# Altium project MB1209.PrjPcb
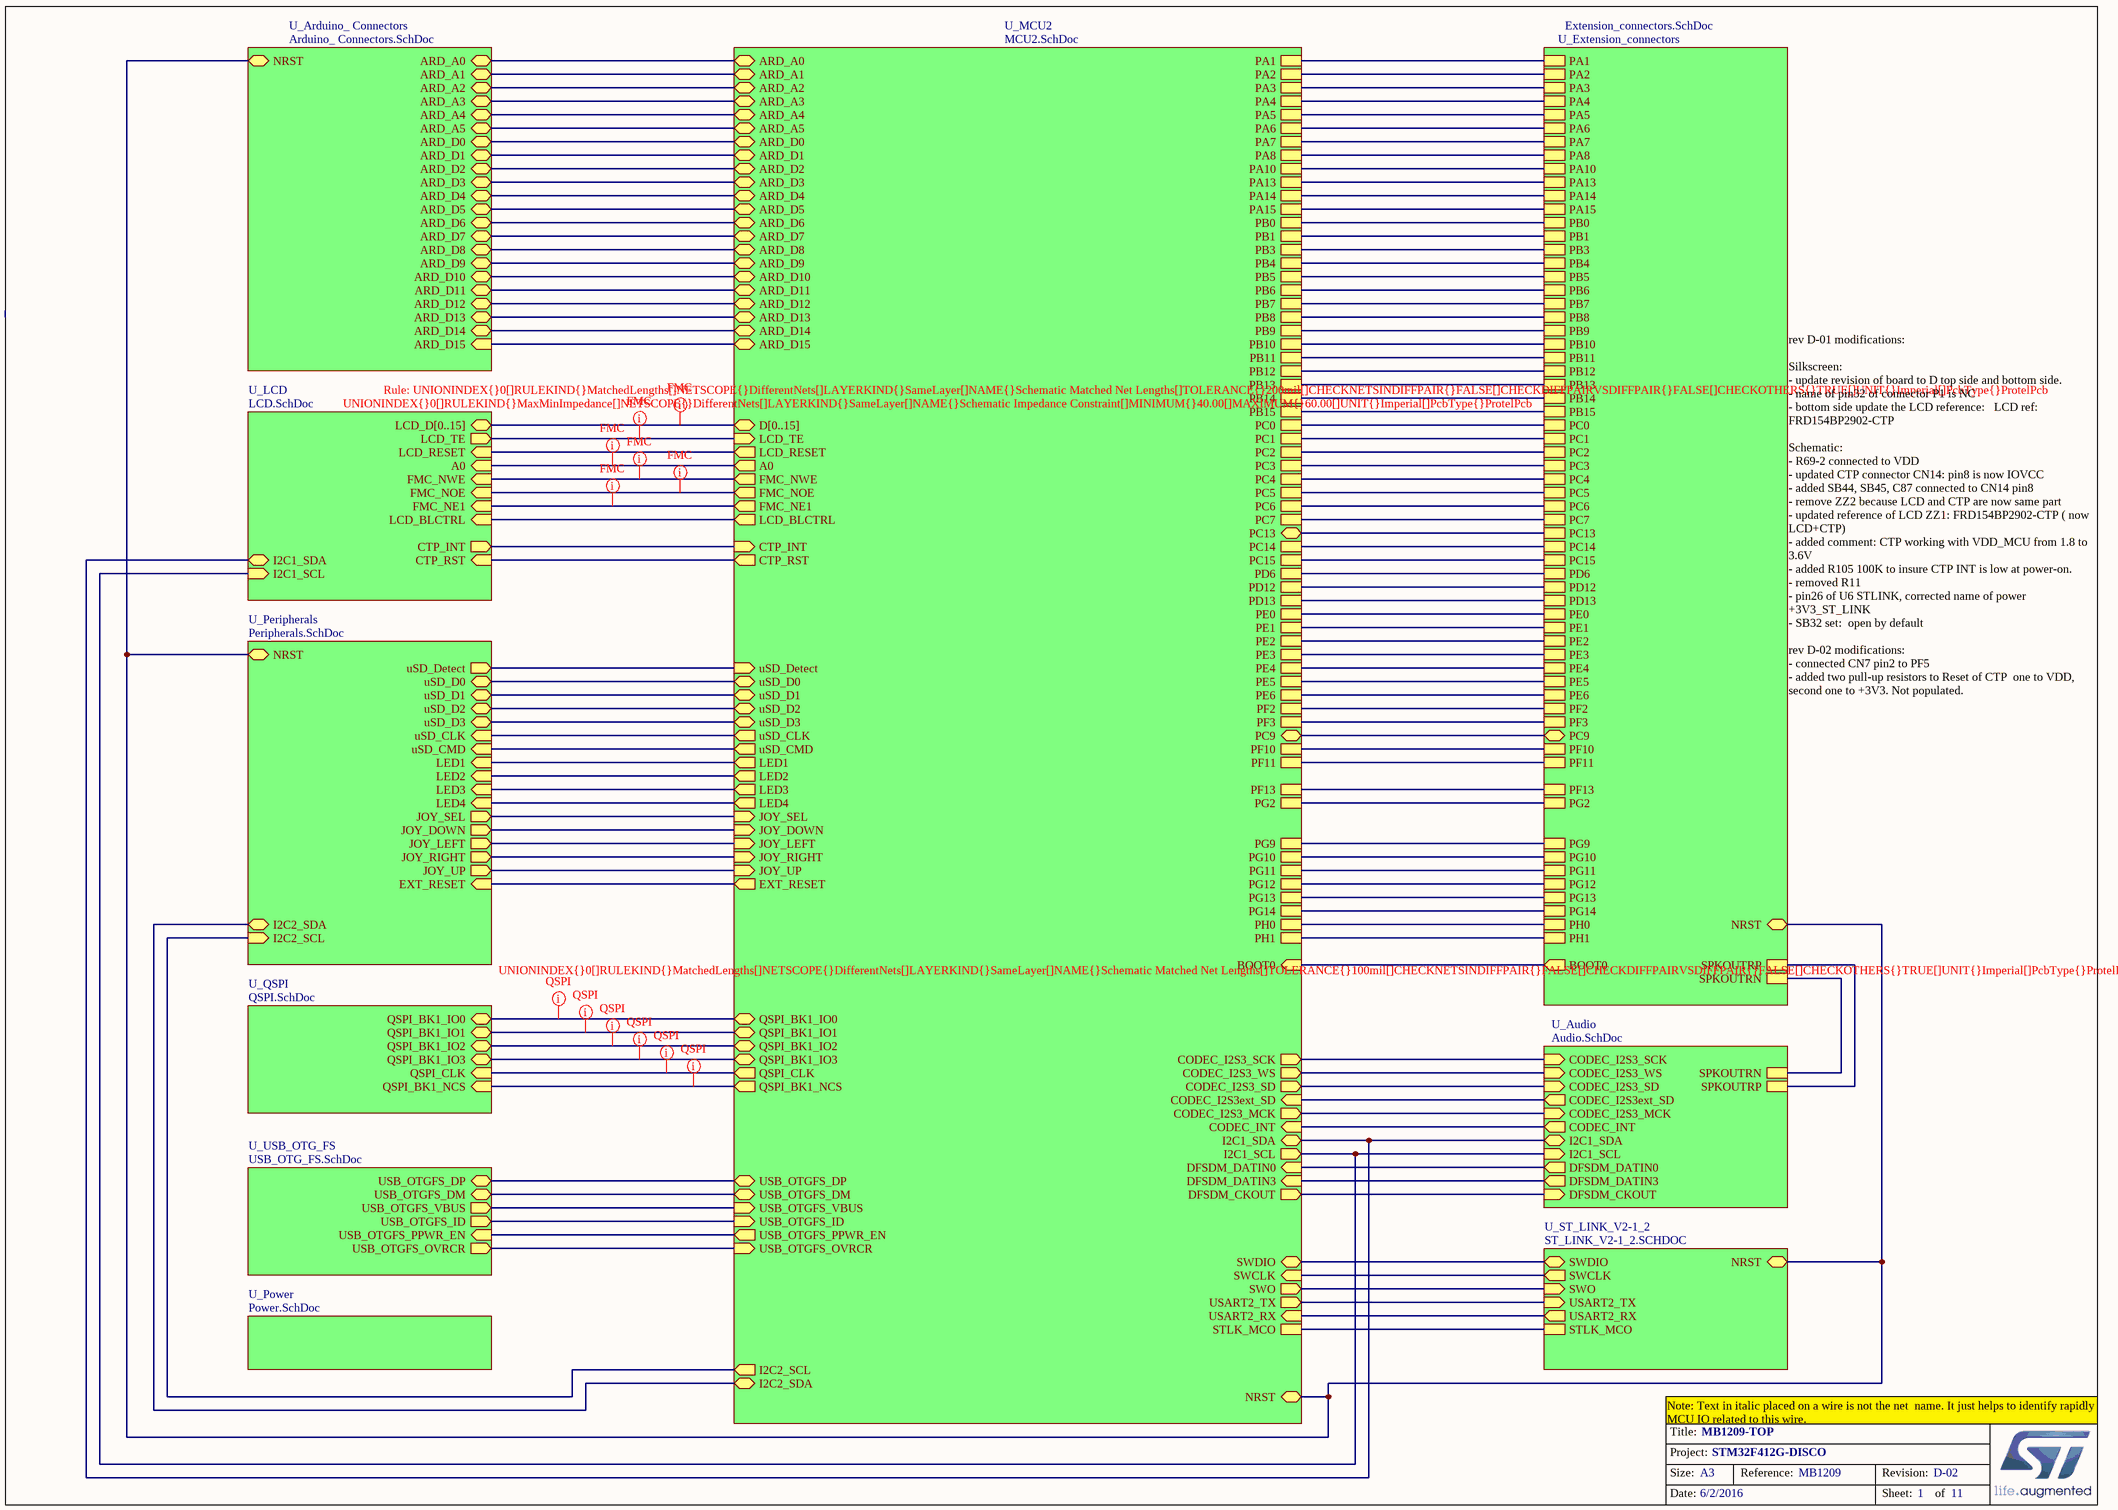
[diagram p0: MB1209.SchDoc]
6 sheets, 144 parts. Net scope: hierarchical (ports join the sheet entries above them; power ports are global).
Sheets:
  MB1209.SchDoc
    U_Extension_connectors = Extension_connectors.SchDoc
    U_Peripherals = Peripherals.SchDoc
    U_QSPI = QSPI.SchDoc
    U_Power = Power.SchDoc
    U_ST_LINK_V2-1_2 = ST_LINK_V2-1_2.SCHDOC

## Sheet MB1209.SchDoc: MB1209-TOP
size A3; Date: 3/31/2015; Author: P.A.; CompanyName: STMicroelectronics; Organization: Microcontrollers Division; Address1: 12, Rue Jules HOROWITZ; Address2: 38019 Grenoble; Address3: FRANCE; DocumentNumber: MB1209; Revision: D-02; SheetNumber: 1; SheetTotal: 11; Project: STM32F412G-DISCO; ModifiedDate: 6/2/2016

### Sub-sheets
U_Arduino_ Connectors = Arduino_ Connectors.SchDoc (file not in this document): NRST (bidir), ARD_A0 (bidir), ARD_A1 (bidir), ARD_A2 (bidir), ARD_A3 (bidir), ARD_A4 (bidir), ARD_A5 (bidir), ARD_D5 (bidir), ARD_D4 (bidir), ARD_D3 (bidir), ARD_D2 (bidir), ARD_D1 (bidir), ARD_D0 (bidir), ARD_D13 (bidir), ARD_D12 (bidir), ARD_D11 (bidir), ARD_D10 (bidir), ARD_D9 (bidir), ARD_D8 (bidir), ARD_D6 (bidir), ARD_D7 (bidir), ARD_D15 (in), ARD_D14 (bidir)
U_Audio = Audio.SchDoc (file not in this document): CODEC_INT (out), DFSDM_DATIN0 (out), DFSDM_CKOUT (in), SPKOUTRN, SPKOUTRP, DFSDM_DATIN3 (out), CODEC_I2S3_SCK (in), CODEC_I2S3_WS (in), CODEC_I2S3_SD (in), I2C1_SCL (in), CODEC_I2S3_MCK (in), I2C1_SDA (bidir), CODEC_I2S3ext_SD (out)
U_Extension_connectors = Extension_connectors.SchDoc: PC0, PC2, PA4, PA6, PC4, PB0, PB10, PB12, PB14, PD12, PC1, PC3, PA1, PA7, PC5, PB1, PA5, PB11, PB13, PB15, PD13, PH1, PC15, PC13, PE1, PB7, PB5, PB3, PE5, PE3, PB9, PD6, PA13, PA15, PC7, PH0, PC14, PE6, PE4, PE2, PE0, PB8, PB6, PA14, PA10, PA8, PB4, PC6, PA2, PA3, PF2, PF3, PF10, PF11, PF13, PG2, PG9, PG10, PG11, PG12, PG13, PG14, SPKOUTRN, SPKOUTRP, BOOT0 (out), NRST, PC9 (bidir)
U_LCD = LCD.SchDoc (file not in this document): LCD_RESET (in), A0 (in), FMC_NWE (in), FMC_NOE (in), FMC_NE1 (in), LCD_TE (out), LCD_BLCTRL (in), LCD_D[0..15] (bidir), I2C1_SDA (bidir), I2C1_SCL (in), CTP_INT (out), CTP_RST (in)
U_MCU2 = MCU2.SchDoc (file not in this document): uSD_D0 (bidir), uSD_D1 (bidir), uSD_D2 (bidir), uSD_D3 (bidir), uSD_CLK (out), uSD_CMD (out), D[0..15] (bidir), A0 (out), NRST (bidir), QSPI_BK1_IO3 (bidir), FMC_NOE (out), FMC_NWE (out), LED3 (out), LED4 (out), QSPI_BK1_IO2 (bidir), QSPI_BK1_IO0 (bidir), QSPI_BK1_IO1 (bidir), uSD_Detect (in), USB_OTGFS_VBUS (in), USB_OTGFS_ID (in), USB_OTGFS_DM (bidir), DFSDM_DATIN0 (in), QSPI_CLK (out), DFSDM_CKOUT (out), FMC_NE1 (out), LCD_RESET (out), LED1 (out), LED2 (out), JOY_RIGHT (in), JOY_LEFT (in), JOY_UP (in), JOY_DOWN (in), QSPI_BK1_NCS (out), USB_OTGFS_OVRCR (in), USB_OTGFS_PPWR_EN (out), SWO (out), SWDIO (bidir), SWCLK (in), USART2_TX (out), USART2_RX (in), EXT_RESET (out), PH0, PH1, STLK_MCO, JOY_SEL (in), CODEC_INT (in), LCD_TE (in), LCD_BLCTRL (out), PC0, PC2, PD12, PC1, PC3, PD13, PE6, PE4, PE2, PE0, PE1, PE5, PE3, PD6, PA4, PA6, PA2, PA1, PA7, PA5, PA3, PA14, PA10, PA8, PA13, PA15, PB10, PB12, PB14, PB11, PB13, PB15, PB8, PB6, PB4, PB7, PB5, PB3, PB9, PC4, PC5, PC14, PC6, PC15, PC7, PB1, PB0, PF2, PF3, PF10, PF11, PF13, PG2, PG9, PG10, PG11, PG12, PG13, PG14, I2C2_SDA (bidir), I2C2_SCL (out), USB_OTGFS_DP (bidir), PC13, BOOT0 (in), DFSDM_DATIN3 (in), I2C1_SCL (out), I2C1_SDA (bidir), CODEC_I2S3_WS (out), CODEC_I2S3_SCK (out), CODEC_I2S3_SD (out), CODEC_I2S3_MCK (out), CODEC_I2S3ext_SD (in), CTP_INT (in), ARD_D3 (bidir), CTP_RST (out), ARD_D5, ARD_D4, ARD_A0, ARD_D2, ARD_D1, ARD_D0, ARD_D8, ARD_D7, ARD_A1, ARD_A2, ARD_A3, ARD_A4, ARD_D12, ARD_D13, ARD_D11, ARD_D10, ARD_A5, ARD_D15, ARD_D14, ARD_D9, ARD_D6, PC9 (bidir)
U_Peripherals = Peripherals.SchDoc: uSD_CLK (in), uSD_CMD (in), uSD_D0 (bidir), uSD_D1 (bidir), uSD_D2 (bidir), uSD_D3 (bidir), uSD_Detect (out), EXT_RESET (in), LED1 (in), LED2 (in), LED3 (in), LED4 (in), NRST (bidir), I2C2_SDA (bidir), I2C2_SCL (in), JOY_SEL (out), JOY_DOWN (out), JOY_LEFT (out), JOY_RIGHT (out), JOY_UP (out)
U_Power = Power.SchDoc: no entries
U_QSPI = QSPI.SchDoc: QSPI_BK1_IO0 (bidir), QSPI_BK1_IO2 (bidir), QSPI_BK1_IO1 (bidir), QSPI_BK1_IO3 (bidir), QSPI_CLK (in), QSPI_BK1_NCS (in)
U_ST_LINK_V2-1_2 = ST_LINK_V2-1_2.SCHDOC: STLK_MCO, NRST (bidir), SWCLK (out), SWDIO (bidir), SWO (in), USART2_TX (in), USART2_RX (out)
U_USB_OTG_FS = USB_OTG_FS.SchDoc (file not in this document): USB_OTGFS_VBUS (out), USB_OTGFS_DM (bidir), USB_OTGFS_DP (bidir), USB_OTGFS_ID (out), USB_OTGFS_OVRCR (out), USB_OTGFS_PPWR_EN (in)

### Nets
BOOT0: sheet U_MCU2/BOOT0, sheet U_Extension_connectors/BOOT0
NRST: sheet U_MCU2/NRST, sheet U_Extension_connectors/NRST, sheet U_Arduino_ Connectors/NRST, sheet U_Peripherals/NRST, sheet U_ST_LINK_V2-1_2/NRST
PA1: sheet U_MCU2/PA1, sheet U_Extension_connectors/PA1
PA2: sheet U_MCU2/PA2, sheet U_Extension_connectors/PA2
PA3: sheet U_MCU2/PA3, sheet U_Extension_connectors/PA3
PA4: sheet U_MCU2/PA4, sheet U_Extension_connectors/PA4
PA5: sheet U_MCU2/PA5, sheet U_Extension_connectors/PA5
PA6: sheet U_MCU2/PA6, sheet U_Extension_connectors/PA6
PA7: sheet U_MCU2/PA7, sheet U_Extension_connectors/PA7
PA8: sheet U_MCU2/PA8, sheet U_Extension_connectors/PA8
PA10: sheet U_MCU2/PA10, sheet U_Extension_connectors/PA10
PA13: sheet U_MCU2/PA13, sheet U_Extension_connectors/PA13
PA14: sheet U_MCU2/PA14, sheet U_Extension_connectors/PA14
PA15: sheet U_MCU2/PA15, sheet U_Extension_connectors/PA15
PB0: sheet U_MCU2/PB0, sheet U_Extension_connectors/PB0
PB1: sheet U_MCU2/PB1, sheet U_Extension_connectors/PB1
PB3: sheet U_MCU2/PB3, sheet U_Extension_connectors/PB3
PB4: sheet U_MCU2/PB4, sheet U_Extension_connectors/PB4
PB5: sheet U_MCU2/PB5, sheet U_Extension_connectors/PB5
PB6: sheet U_MCU2/PB6, sheet U_Extension_connectors/PB6
PB7: sheet U_MCU2/PB7, sheet U_Extension_connectors/PB7
PB8: sheet U_MCU2/PB8, sheet U_Extension_connectors/PB8
PB9: sheet U_MCU2/PB9, sheet U_Extension_connectors/PB9
PB10: sheet U_MCU2/PB10, sheet U_Extension_connectors/PB10
PB11: sheet U_MCU2/PB11, sheet U_Extension_connectors/PB11
PB12: sheet U_MCU2/PB12, sheet U_Extension_connectors/PB12
PB13: sheet U_MCU2/PB13, sheet U_Extension_connectors/PB13
PB14: sheet U_MCU2/PB14, sheet U_Extension_connectors/PB14
PB15: sheet U_MCU2/PB15, sheet U_Extension_connectors/PB15
PC0: sheet U_MCU2/PC0, sheet U_Extension_connectors/PC0
PC1: sheet U_MCU2/PC1, sheet U_Extension_connectors/PC1
PC2: sheet U_MCU2/PC2, sheet U_Extension_connectors/PC2
PC3: sheet U_MCU2/PC3, sheet U_Extension_connectors/PC3
PC4: sheet U_MCU2/PC4, sheet U_Extension_connectors/PC4
PC5: sheet U_MCU2/PC5, sheet U_Extension_connectors/PC5
PC6: sheet U_MCU2/PC6, sheet U_Extension_connectors/PC6
PC7: sheet U_MCU2/PC7, sheet U_Extension_connectors/PC7
PC13: sheet U_MCU2/PC13, sheet U_Extension_connectors/PC13
PC14: sheet U_MCU2/PC14, sheet U_Extension_connectors/PC14
PC15: sheet U_MCU2/PC15, sheet U_Extension_connectors/PC15
PD6: sheet U_MCU2/PD6, sheet U_Extension_connectors/PD6
PD12: sheet U_MCU2/PD12, sheet U_Extension_connectors/PD12
PD13: sheet U_MCU2/PD13, sheet U_Extension_connectors/PD13
PE0: sheet U_MCU2/PE0, sheet U_Extension_connectors/PE0
PE1: sheet U_MCU2/PE1, sheet U_Extension_connectors/PE1
PE2: sheet U_MCU2/PE2, sheet U_Extension_connectors/PE2
PE3: sheet U_MCU2/PE3, sheet U_Extension_connectors/PE3
PE4: sheet U_MCU2/PE4, sheet U_Extension_connectors/PE4
PE5: sheet U_MCU2/PE5, sheet U_Extension_connectors/PE5
PE6: sheet U_MCU2/PE6, sheet U_Extension_connectors/PE6
PF2: sheet U_MCU2/PF2, sheet U_Extension_connectors/PF2
PF3: sheet U_MCU2/PF3, sheet U_Extension_connectors/PF3
PF10: sheet U_MCU2/PF10, sheet U_Extension_connectors/PF10
PF11: sheet U_MCU2/PF11, sheet U_Extension_connectors/PF11
PF13: sheet U_MCU2/PF13, sheet U_Extension_connectors/PF13
PG2: sheet U_MCU2/PG2, sheet U_Extension_connectors/PG2
PG9: sheet U_MCU2/PG9, sheet U_Extension_connectors/PG9
PG10: sheet U_MCU2/PG10, sheet U_Extension_connectors/PG10
PG11: sheet U_MCU2/PG11, sheet U_Extension_connectors/PG11
PG12: sheet U_MCU2/PG12, sheet U_Extension_connectors/PG12
PG13: sheet U_MCU2/PG13, sheet U_Extension_connectors/PG13
PG14: sheet U_MCU2/PG14, sheet U_Extension_connectors/PG14
PH0: sheet U_MCU2/PH0, sheet U_Extension_connectors/PH0
PH1: sheet U_MCU2/PH1, sheet U_Extension_connectors/PH1
QSPI_BK1_IO0: sheet U_MCU2/QSPI_BK1_IO0, sheet U_QSPI/QSPI_BK1_IO0
QSPI_BK1_IO1: sheet U_MCU2/QSPI_BK1_IO1, sheet U_QSPI/QSPI_BK1_IO1
QSPI_BK1_IO2: sheet U_MCU2/QSPI_BK1_IO2, sheet U_QSPI/QSPI_BK1_IO2
QSPI_BK1_IO3: sheet U_MCU2/QSPI_BK1_IO3, sheet U_QSPI/QSPI_BK1_IO3
QSPI_BK1_NCS: sheet U_MCU2/QSPI_BK1_NCS, sheet U_QSPI/QSPI_BK1_NCS
QSPI_CLK: sheet U_MCU2/QSPI_CLK, sheet U_QSPI/QSPI_CLK
SPKOUTRN: sheet U_Extension_connectors/SPKOUTRN, sheet U_Audio/SPKOUTRN
SPKOUTRP: sheet U_Extension_connectors/SPKOUTRP, sheet U_Audio/SPKOUTRP
NetB2_1: sheet U_MCU2/JOY_LEFT, sheet U_Peripherals/JOY_LEFT
NetB2_2: sheet U_MCU2/JOY_SEL, sheet U_Peripherals/JOY_SEL
NetB2_3: sheet U_MCU2/JOY_DOWN, sheet U_Peripherals/JOY_DOWN
NetB2_4: sheet U_MCU2/JOY_RIGHT, sheet U_Peripherals/JOY_RIGHT
NetB2_6: sheet U_MCU2/JOY_UP, sheet U_Peripherals/JOY_UP
NetC69_1: sheet U_MCU2/STLK_MCO, sheet U_ST_LINK_V2-1_2/STLK_MCO
NetCN10_1: sheet U_MCU2/I2C2_SDA, sheet U_Peripherals/I2C2_SDA
NetCN10_3: sheet U_MCU2/I2C2_SCL, sheet U_Peripherals/I2C2_SCL
NetCN10_4: sheet U_MCU2/EXT_RESET, sheet U_Peripherals/EXT_RESET
NetCN13_1: sheet U_MCU2/uSD_D2, sheet U_Peripherals/uSD_D2
NetCN13_2: sheet U_MCU2/uSD_D3, sheet U_Peripherals/uSD_D3
NetCN13_3: sheet U_MCU2/uSD_CMD, sheet U_Peripherals/uSD_CMD
NetCN13_5: sheet U_MCU2/uSD_CLK, sheet U_Peripherals/uSD_CLK
NetCN13_7: sheet U_MCU2/uSD_D0, sheet U_Peripherals/uSD_D0
NetCN13_8: sheet U_MCU2/uSD_D1, sheet U_Peripherals/uSD_D1
NetP2_46: sheet U_MCU2/PC9, sheet U_Extension_connectors/PC9
NetR2_1: sheet U_MCU2/LED4, sheet U_Peripherals/LED4
NetR3_1: sheet U_MCU2/LED3, sheet U_Peripherals/LED3
NetR4_1: sheet U_MCU2/LED2, sheet U_Peripherals/LED2
NetR5_1: sheet U_MCU2/LED1, sheet U_Peripherals/LED1
NetR49_1: sheet U_MCU2/USART2_RX, sheet U_ST_LINK_V2-1_2/USART2_RX
NetR61_1: sheet U_MCU2/USART2_TX, sheet U_ST_LINK_V2-1_2/USART2_TX
NetR64_1: sheet U_MCU2/uSD_Detect, sheet U_Peripherals/uSD_Detect
NetSB2_1: sheet U_MCU2/SWDIO, sheet U_ST_LINK_V2-1_2/SWDIO
NetSB11_1: sheet U_MCU2/SWCLK, sheet U_ST_LINK_V2-1_2/SWCLK
NetSB28_2: sheet U_MCU2/SWO, sheet U_ST_LINK_V2-1_2/SWO
(unnamed): sheet U_MCU2/A0, sheet U_LCD/A0
(unnamed): sheet U_MCU2/FMC_NOE, sheet U_LCD/FMC_NOE
(unnamed): sheet U_MCU2/FMC_NWE, sheet U_LCD/FMC_NWE
(unnamed): sheet U_MCU2/USB_OTGFS_VBUS, sheet U_USB_OTG_FS/USB_OTGFS_VBUS
(unnamed): sheet U_MCU2/USB_OTGFS_ID, sheet U_USB_OTG_FS/USB_OTGFS_ID
(unnamed): sheet U_MCU2/USB_OTGFS_DM, sheet U_USB_OTG_FS/USB_OTGFS_DM
(unnamed): sheet U_MCU2/DFSDM_DATIN0, sheet U_Audio/DFSDM_DATIN0
(unnamed): sheet U_MCU2/DFSDM_CKOUT, sheet U_Audio/DFSDM_CKOUT
(unnamed): sheet U_MCU2/FMC_NE1, sheet U_LCD/FMC_NE1
(unnamed): sheet U_MCU2/LCD_RESET, sheet U_LCD/LCD_RESET
(unnamed): sheet U_MCU2/USB_OTGFS_OVRCR, sheet U_USB_OTG_FS/USB_OTGFS_OVRCR
(unnamed): sheet U_MCU2/USB_OTGFS_PPWR_EN, sheet U_USB_OTG_FS/USB_OTGFS_PPWR_EN
(unnamed): sheet U_MCU2/CODEC_INT, sheet U_Audio/CODEC_INT
(unnamed): sheet U_MCU2/LCD_TE, sheet U_LCD/LCD_TE
(unnamed): sheet U_MCU2/LCD_BLCTRL, sheet U_LCD/LCD_BLCTRL
(unnamed): sheet U_MCU2/USB_OTGFS_DP, sheet U_USB_OTG_FS/USB_OTGFS_DP
(unnamed): sheet U_MCU2/DFSDM_DATIN3, sheet U_Audio/DFSDM_DATIN3
(unnamed): sheet U_MCU2/I2C1_SCL, sheet U_Audio/I2C1_SCL, sheet U_LCD/I2C1_SCL
(unnamed): sheet U_MCU2/I2C1_SDA, sheet U_Audio/I2C1_SDA, sheet U_LCD/I2C1_SDA
(unnamed): sheet U_MCU2/CODEC_I2S3_WS, sheet U_Audio/CODEC_I2S3_WS
(unnamed): sheet U_MCU2/CODEC_I2S3_SCK, sheet U_Audio/CODEC_I2S3_SCK
(unnamed): sheet U_MCU2/CODEC_I2S3_SD, sheet U_Audio/CODEC_I2S3_SD
(unnamed): sheet U_MCU2/CODEC_I2S3_MCK, sheet U_Audio/CODEC_I2S3_MCK
(unnamed): sheet U_MCU2/CODEC_I2S3ext_SD, sheet U_Audio/CODEC_I2S3ext_SD
(unnamed): sheet U_MCU2/CTP_INT, sheet U_LCD/CTP_INT
(unnamed): sheet U_MCU2/ARD_D3, sheet U_Arduino_ Connectors/ARD_D3
(unnamed): sheet U_MCU2/CTP_RST, sheet U_LCD/CTP_RST
(unnamed): sheet U_MCU2/ARD_D5, sheet U_Arduino_ Connectors/ARD_D5
(unnamed): sheet U_MCU2/ARD_D4, sheet U_Arduino_ Connectors/ARD_D4
(unnamed): sheet U_MCU2/ARD_A0, sheet U_Arduino_ Connectors/ARD_A0
(unnamed): sheet U_MCU2/ARD_D2, sheet U_Arduino_ Connectors/ARD_D2
(unnamed): sheet U_MCU2/ARD_D1, sheet U_Arduino_ Connectors/ARD_D1
(unnamed): sheet U_MCU2/ARD_D0, sheet U_Arduino_ Connectors/ARD_D0
(unnamed): sheet U_MCU2/ARD_D8, sheet U_Arduino_ Connectors/ARD_D8
(unnamed): sheet U_MCU2/ARD_D7, sheet U_Arduino_ Connectors/ARD_D7
(unnamed): sheet U_MCU2/ARD_A1, sheet U_Arduino_ Connectors/ARD_A1
(unnamed): sheet U_MCU2/ARD_A2, sheet U_Arduino_ Connectors/ARD_A2
(unnamed): sheet U_MCU2/ARD_A3, sheet U_Arduino_ Connectors/ARD_A3
(unnamed): sheet U_MCU2/ARD_A4, sheet U_Arduino_ Connectors/ARD_A4
(unnamed): sheet U_MCU2/ARD_D12, sheet U_Arduino_ Connectors/ARD_D12
(unnamed): sheet U_MCU2/ARD_D13, sheet U_Arduino_ Connectors/ARD_D13
(unnamed): sheet U_MCU2/ARD_D11, sheet U_Arduino_ Connectors/ARD_D11
(unnamed): sheet U_MCU2/ARD_D10, sheet U_Arduino_ Connectors/ARD_D10
(unnamed): sheet U_MCU2/ARD_A5, sheet U_Arduino_ Connectors/ARD_A5
(unnamed): sheet U_MCU2/ARD_D15, sheet U_Arduino_ Connectors/ARD_D15
(unnamed): sheet U_MCU2/ARD_D14, sheet U_Arduino_ Connectors/ARD_D14
(unnamed): sheet U_MCU2/ARD_D9, sheet U_Arduino_ Connectors/ARD_D9
(unnamed): sheet U_MCU2/ARD_D6, sheet U_Arduino_ Connectors/ARD_D6

### Buses and harness runs
bus sheet U_LCD/LCD_D[0..15] = sheet U_MCU2/D[0..15]

### Layout directives
rule Matched Net Lengths [Tolerance = 200mil]; rule ? ; rule Impedance Constraint [Min = 40.00    Max = 60.00    ]: (no net found under the mark)
rule Matched Net Lengths [Tolerance = 200mil]; rule Impedance Constraint [Min = 40.00    Max = 60.00    ]: (no net found under the mark)
rule Matched Net Lengths [Tolerance = 100mil]: QSPI_BK1_IO0, QSPI_BK1_IO1, QSPI_BK1_IO2, QSPI_BK1_IO3, QSPI_BK1_NCS, QSPI_CLK

### Notes on the sheet
- rev D-01 modifications:
  Silkscreen:
  - update revision of board to D top side and bottom side.
  - name of pin32 of connector P1 is NC
  - bottom side update the LCD reference:   LCD ref: FRD154BP2902-CTP
  Schematic:
  - R69-2 connected to VDD
  - updated CTP connector CN14: pin8 is now IOVCC
  - added SB44, SB45, C87 connected to CN14 pin8
  - remove ZZ2 because LCD and CTP are now same part
  - updated reference of LCD ZZ1: FRD154BP2902-CTP ( now LCD+CTP)
  - added comment: CTP working with VDD_MCU from 1.8 to 3.6V
  - added R105 100K to insure CTP INT is low at power-on.
  - removed R11
  - pin26 of U6 STLINK, corrected name of power +3V3_ST_LINK
  - SB32 set:  open by default
  rev D-02 modifications:
  - connected CN7 pin2 to PF5
  - added two pull-up resistors to Reset of CTP  one to VDD, second one to +3V3. Not populated.
- Note: Text in italic placed on a wire is not the net  name. It just helps to identify rapidly MCU IO related to this wire.
- Title:
- Project:
- Size:
- Date:
- A3
- Reference:
- Sheet:
- Revision:
- of

## Sheet Extension_connectors.SchDoc: Extension connectors
size A4; Date: 01-DEC-2013; Author: P.A.; CompanyName: STMicroelectronics; Organization: Microcontrollers Division; Address1: 12, Rue Jules HOROWITZ; Address2: 38019 Grenoble; Address3: FRANCE; DocumentNumber: MB1209; Revision: D-02; SheetNumber: 9; SheetTotal: 11; Project: STM32F412G-DISCO; PageSetup: Record=PageOptions|CenterHorizontal=True|CenterVertical=True|PrintScale=1.38|XCorrection=1.00|YCorrection=1.00|PrintKind=1|BorderSize=5000000|LeftOffset=0|BottomOffset=0|Orientation=2|PaperLength=1000|PaperWidth=1000|Scale=100|PaperSource=15|PrintQuality=600|MediaType=1|DitherType=10|PaperKind=A3|PrintScaleMode=1; ModifiedDate: 6/2/2016
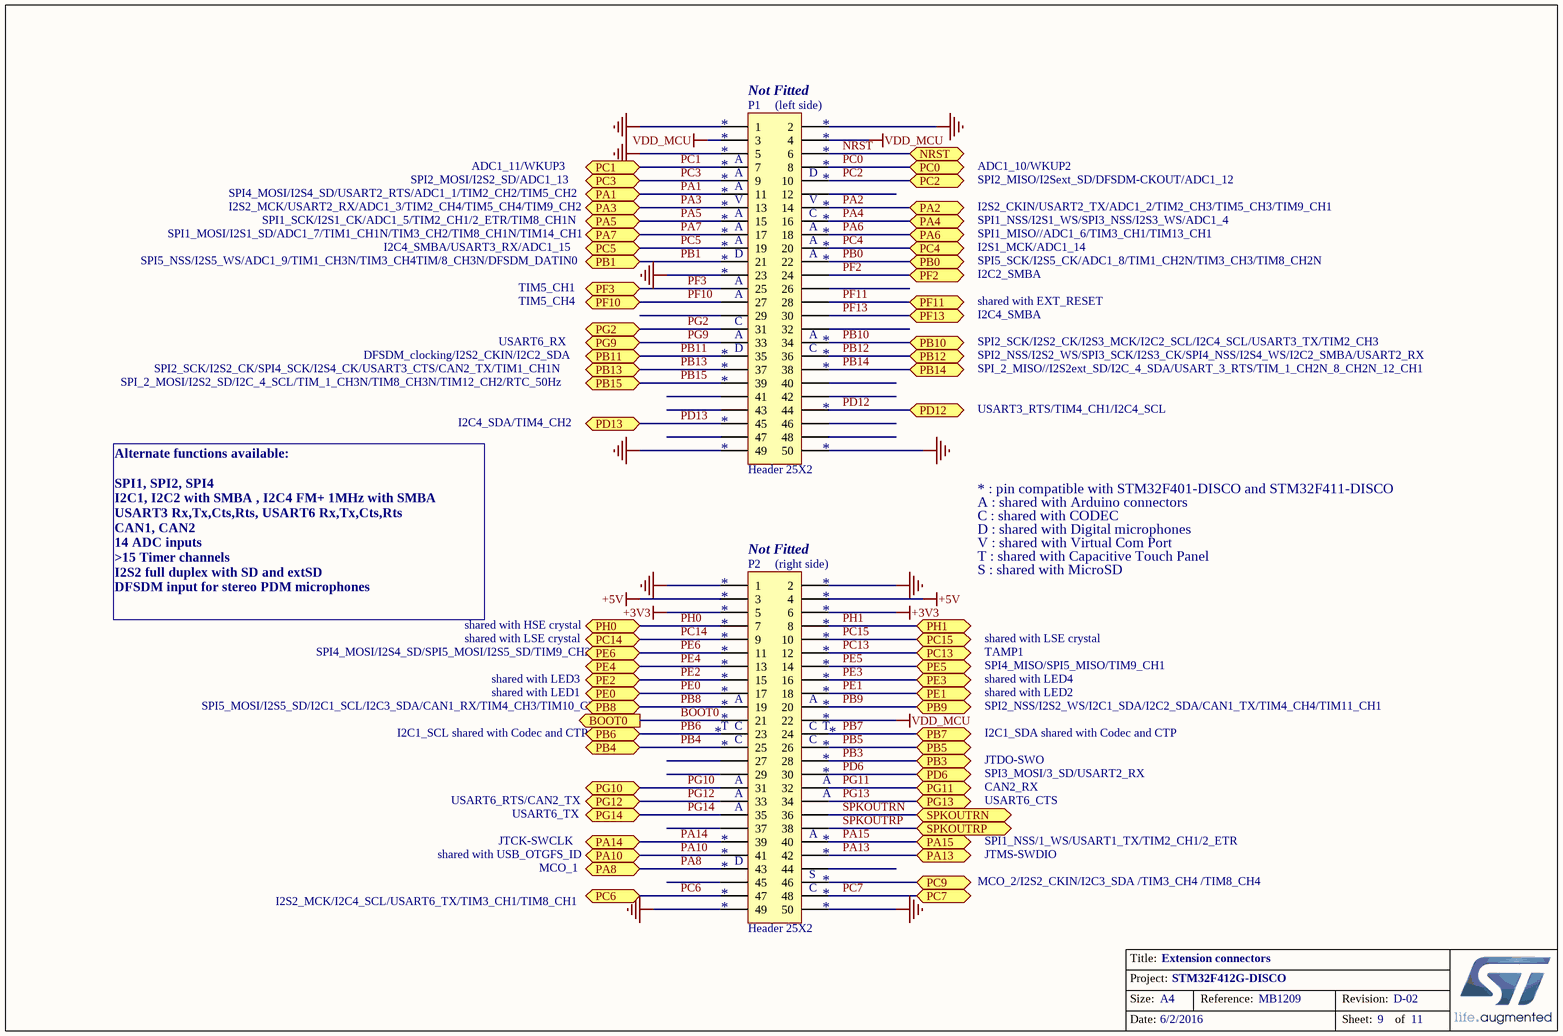
[diagram p1: Extension_connectors.SchDoc]

### Parts
P1  Header 25X2  [HDR_2X25_2R54_W]
P2  Header 25X2  [HDR_2X25_2R54_W]

### Ports
BOOT0 (out), NRST, PA1, PA2, PA3, PA4, PA5, PA6, PA7, PA8, PA10, PA13, PA14, PA15, PB0, PB1, PB3, PB4, PB5, PB6, PB7, PB8, PB9, PB10, PB11, PB12, PB13, PB14, PB15, PC0, PC1, PC2, PC3, PC4, PC5, PC6, PC7, PC9 (bidir), PC13, PC14, PC15, PD6, PD12, PD13, PE0, PE1, PE2, PE3, PE4, PE5, PE6, PF2, PF3, PF10, PF11, PF13, PG2, PG9, PG10, PG11, PG12, PG13, PG14, PH0, PH1, SPKOUTRN, SPKOUTRP

### Nets
+3V3: P2.5 P2.6
+5V: P2.3 P2.4
GND: P1.1 P1.2 P1.5 P1.23 P1.49 P1.50 P2.1 P2.2 P2.49 P2.50
VDD_MCU: P1.3 P1.4 P2.22
BOOT0: P2.21 ; port BOOT0
NRST: P1.6 ; port NRST
PA1: P1.11 ; port PA1
PA2: P1.14 ; port PA2
PA3: P1.13 ; port PA3
PA4: P1.16 ; port PA4
PA5: P1.15 ; port PA5
PA6: P1.18 ; port PA6
PA7: P1.17 ; port PA7
PA8: P2.43 ; port PA8
PA10: P2.41 ; port PA10
PA13: P2.42 ; port PA13
PA14: P2.39 ; port PA14
PA15: P2.40 ; port PA15
PB0: P1.22 ; port PB0
PB1: P1.21 ; port PB1
PB3: P2.28 ; port PB3
PB4: P2.25 ; port PB4
PB5: P2.26 ; port PB5
PB6: P2.23 ; port PB6
PB7: P2.24 ; port PB7
PB8: P2.19 ; port PB8
PB9: P2.20 ; port PB9
PB10: P1.34 ; port PB10
PB11: P1.35 ; port PB11
PB12: P1.36 ; port PB12
PB13: P1.37 ; port PB13
PB14: P1.38 ; port PB14
PB15: P1.39 ; port PB15
PC0: P1.8 ; port PC0
PC1: P1.7 ; port PC1
PC2: P1.10 ; port PC2
PC3: P1.9 ; port PC3
PC4: P1.20 ; port PC4
PC5: P1.19 ; port PC5
PC6: P2.47 ; port PC6
PC7: P2.48 ; port PC7
PC13: P2.12 ; port PC13
PC14: P2.9 ; port PC14
PC15: P2.10 ; port PC15
PD6: P2.30 ; port PD6
PD12: P1.44 ; port PD12
PD13: P1.45 ; port PD13
PE0: P2.17 ; port PE0
PE1: P2.18 ; port PE1
PE2: P2.15 ; port PE2
PE3: P2.16 ; port PE3
PE4: P2.13 ; port PE4
PE5: P2.14 ; port PE5
PE6: P2.11 ; port PE6
PF2: P1.24 ; port PF2
PF3: P1.25 ; port PF3
PF10: P1.27 ; port PF10
PF11: P1.28 ; port PF11
PF13: P1.30 ; port PF13
PG2: P1.31 ; port PG2
PG9: P1.33 ; port PG9
PG10: P2.31 ; port PG10
PG11: P2.32 ; port PG11
PG12: P2.33 ; port PG12
PG13: P2.34 ; port PG13
PG14: P2.35 ; port PG14
PH0: P2.7 ; port PH0
PH1: P2.8 ; port PH1
SPKOUTRN: P2.36 ; port SPKOUTRN
SPKOUTRP: P2.38 ; port SPKOUTRP
NetP2_46: P2.46 ; port PC9

Not connected (* = marked no-connect by the designer): P1 12 26 29 32 40 41 42 43 46 47 48; P2 27 29 37 44 45

### Notes on the sheet
- (near P1) Not Fitted
- (near P1) (left side)
- ADC1_11/WKUP3
- (near P1) *
- (near P1) A
- (near P1) D
- ADC1_10/WKUP2
- SPI1_MOSI/I2S1_SD/ADC1_7/TIM1_CH1N/TIM3_CH2/TIM8_CH1N/TIM14_CH1
- SPI4_MOSI/I2S4_SD/USART2_RTS/ADC1_1/TIM2_CH2/TIM5_CH2
- I2S2_MCK/USART2_RX/ADC1_3/TIM2_CH4/TIM5_CH4/TIM9_CH2
- SPI1_SCK/I2S1_CK/ADC1_5/TIM2_CH1/2_ETR/TIM8_CH1N
- I2C4_SMBA/USART3_RX/ADC1_15
- SPI2_MOSI/I2S2_SD/ADC1_13
- (near P1) V
- (near P1) C
- I2S1_MCK/ADC1_14
- SPI1_MISO//ADC1_6/TIM3_CH1/TIM13_CH1
- SPI1_NSS/I2S1_WS/SPI3_NSS/I2S3_WS/ADC1_4
- SPI2_MISO/I2Sext_SD/DFSDM-CKOUT/ADC1_12
- I2S2_CKIN/USART2_TX/ADC1_2/TIM2_CH3/TIM5_CH3/TIM9_CH1
- SPI5_NSS/I2S5_WS/ADC1_9/TIM1_CH3N/TIM3_CH4TIM/8_CH3N/DFSDM_DATIN0
- TIM5_CH1
- TIM5_CH4
- I2C2_SMBA
- SPI5_SCK/I2S5_CK/ADC1_8/TIM1_CH2N/TIM3_CH3/TIM8_CH2N
- shared with EXT_RESET
- SPI_2_MOSI/I2S2_SD/I2C_4_SCL/TIM_1_CH3N/TIM8_CH3N/TIM12_CH2/RTC_50Hz
- SPI2_SCK/I2S2_CK/SPI4_SCK/I2S4_CK/USART3_CTS/CAN2_TX/TIM1_CH1N
- DFSDM_clocking/I2S2_CKIN/I2C2_SDA
- USART6_RX
- SPI2_SCK/I2S2_CK/I2S3_MCK/I2C2_SCL/I2C4_SCL/USART3_TX/TIM2_CH3
- SPI_2_MISO//I2S2ext_SD/I2C_4_SDA/USART_3_RTS/TIM_1_CH2N_8_CH2N_12_CH1
- SPI2_NSS/I2S2_WS/SPI3_SCK/I2S3_CK/SPI4_NSS/I2S4_WS/I2C2_SMBA/USART2_RX
- I2C4_SMBA
- I2C4_SDA/TIM4_CH2
- USART3_RTS/TIM4_CH1/I2C4_SCL
- * : pin compatible with STM32F401-DISCO and STM32F411-DISCO
- A : shared with Arduino connectors
- C : shared with CODEC
- (near P2) Not Fitted
- (near P2) (right side)
- D : shared with Digital microphones
- V : shared with Virtual Com Port
- T : shared with Capacitive Touch Panel
- S : shared with MicroSD
- Alternate functions available:
  SPI1, SPI2, SPI4
  I2C1, I2C2 with SMBA , I2C4 FM+ 1MHz with SMBA
  USART3 Rx,Tx,Cts,Rts, USART6 Rx,Tx,Cts,Rts
  CAN1, CAN2
  14 ADC inputs
  >15 Timer channels
  I2S2 full duplex with SD and extSD
  DFSDM input for stereo PDM microphones
- SPI4_MOSI/I2S4_SD/SPI5_MOSI/I2S5_SD/TIM9_CH2
- shared with LSE crystal
- shared with HSE crystal
- (near P2) *
- TAMP1
- SPI5_MOSI/I2S5_SD/I2C1_SCL/I2C3_SDA/CAN1_RX/TIM4_CH3/TIM10_CH1
- shared with LED3
- shared with LED1
- (near P2) A
- SPI4_MISO/SPI5_MISO/TIM9_CH1
- SPI2_NSS/I2S2_WS/I2C1_SDA/I2C2_SDA/CAN1_TX/TIM4_CH4/TIM11_CH1
- shared with LED4
- shared with LED2
- I2C1_SCL shared with Codec and CTP
- (near P2) T
- (near P2) C
- SPI3_MOSI/3_SD/USART2_RX
- CAN2_RX
- JTDO-SWO
- I2C1_SDA shared with Codec and CTP
- USART6_RTS/CAN2_TX
- JTCK-SWCLK
- USART6_TX
- SPI1_NSS/1_WS/USART1_TX/TIM2_CH1/2_ETR
- USART6_CTS
- I2S2_MCK/I2C4_SCL/USART6_TX/TIM3_CH1/TIM8_CH1
- shared with USB_OTGFS_ID
- MCO_1
- (near P2) D
- (near P2) S
- MCO_2/I2S2_CKIN/I2C3_SDA /TIM3_CH4 /TIM8_CH4
- JTMS-SWDIO
- Title:
- Project:
- Size:
- Date:
- A4
- Reference:
- Sheet:
- Revision:
- of

### Library data of the parts
P1 P2 = Header 25X2: Header, 25-Pin, Dual row; Ordered by: Subcon; Fitted: NO; ECCN_US/EU: NA; LatestRevisionDate: 17-Jul-2002; LatestRevisionNote: Re-released for DXP Platform.; Publisher: Altium Limited

## Sheet Peripherals.SchDoc: Peripherals
size A4; Date: 9/24/2014; Author: P.A.; CompanyName: STMicroelectronics; Organization: Microcontrollers Division; Address1: 12, Rue Jules HOROWITZ; Address2: 38019 Grenoble; Address3: FRANCE; DocumentNumber: MB1209; Revision: D-02; SheetNumber: 6; SheetTotal: 11; Project: STM32F412G-DISCO; ModifiedDate: 6/2/2016
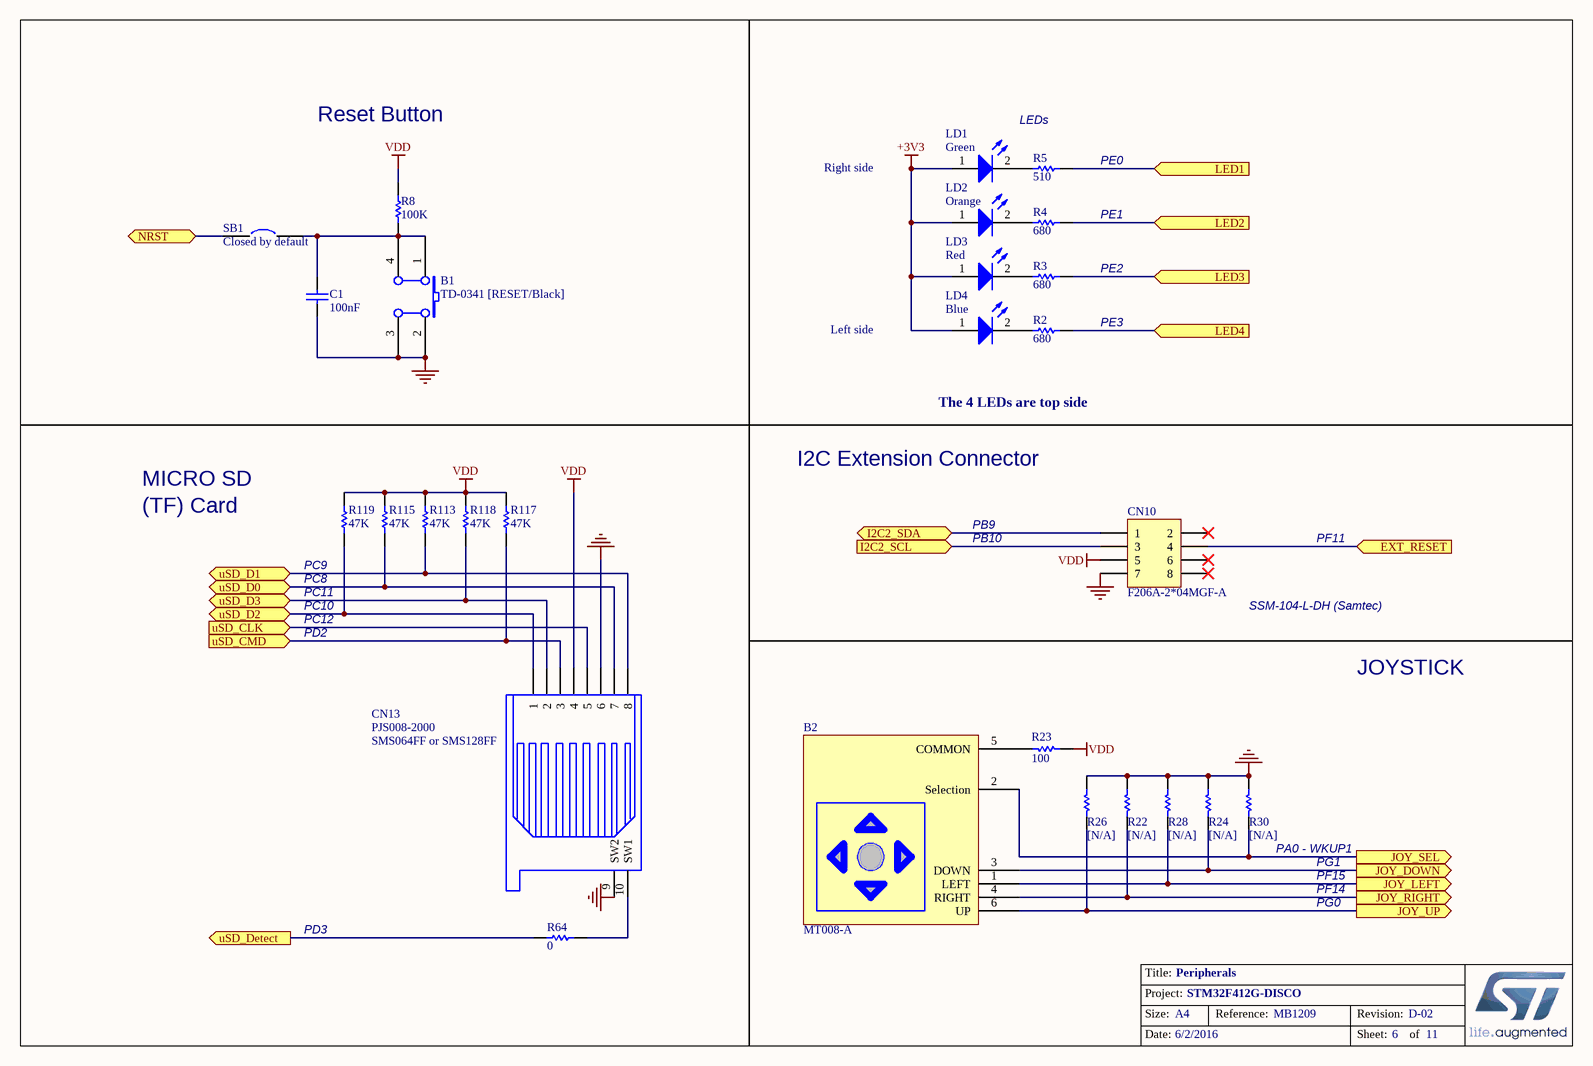
[diagram p2: Peripherals.SchDoc]

### Parts
B1  TD-0341 [RESET/Black]  [PB10]
B2  MT008-A  [MT-008A]
C1  100nF  [0402C]
CN10  F206A-2*04MGF-A  [SSM-104-L-DH]
CN13  PJS008-2000  [MSD_PJS008_]
LD1  Green  [0603D]
LD2  Orange  [0603D]
LD3  Red  [0603D]
LD4  Blue  [0603D]
R2  680  [0402R]
R3  680  [0402R]
R4  680  [0402R]
R5  510  [0603R]
R8  100K  [0402R]
R22  [N/A]  [0402R]
R23  100  [0402R]
R24  [N/A]  [0402R]
R26  [N/A]  [0402R]
R28  [N/A]  [0402R]
R30  [N/A]  [0402R]
R64  0  [SB_0603]
R113  47K  [0402R]
R115  47K  [0402R]
R117  47K  [0402R]
R118  47K  [0402R]
R119  47K  [0402R]
SB1  Closed by default  [SB_0603]

### Ports
EXT_RESET (in), I2C2_SCL (in), I2C2_SDA (bidir), JOY_DOWN (out), JOY_LEFT (out), JOY_RIGHT (out), JOY_SEL (out), JOY_UP (out), LED1 (in), LED2 (in), LED3 (in), LED4 (in), NRST (bidir), uSD_CLK (in), uSD_CMD (in), uSD_D0 (bidir), uSD_D1 (bidir), uSD_D2 (bidir), uSD_D3 (bidir), uSD_Detect (out)

### Nets
+3V3: LD1.1(A) LD2.1(A) LD3.1(A) LD4.1(A)
GND: B1.2(B0) B1.3(B1) C1.1 CN10.7 CN13.6 CN13.9(SW2) R22.2 R24.2 R26.2 R28.2 R30.1
VDD: CN10.5 CN13.4 R8.1 R23.1 R113.1 R115.1 R117.1 R118.1 R119.1
NRST: SB1.1 ; port NRST
NetB1_1: B1.1(A0) B1.4(A1) C1.2 R8.2 SB1.2
NetB2_1: B2.1(LEFT) R28.1 ; port JOY_LEFT
NetB2_2: B2.2(Selection) R30.2 ; port JOY_SEL
NetB2_3: B2.3(DOWN) R24.1 ; port JOY_DOWN
NetB2_4: B2.4(RIGHT) R22.1 ; port JOY_RIGHT
NetB2_5: B2.5(COMMON) R23.2
NetB2_6: B2.6(UP) R26.1 ; port JOY_UP
NetCN10_1: CN10.1 ; port I2C2_SDA
NetCN10_3: CN10.3 ; port I2C2_SCL
NetCN10_4: CN10.4 ; port EXT_RESET
NetCN13_1: CN13.1 R119.2 ; port uSD_D2
NetCN13_2: CN13.2 R118.2 ; port uSD_D3
NetCN13_3: CN13.3 R117.2 ; port uSD_CMD
NetCN13_5: CN13.5 ; port uSD_CLK
NetCN13_7: CN13.7 R115.2 ; port uSD_D0
NetCN13_8: CN13.8 R113.2 ; port uSD_D1
NetCN13_10: CN13.10(SW1) R64.2
NetLD1_2: LD1.2(K) R5.2
NetLD2_2: LD2.2(K) R4.2
NetLD3_2: LD3.2(K) R3.2
NetLD4_2: LD4.2(K) R2.2
NetR2_1: R2.1 ; port LED4
NetR3_1: R3.1 ; port LED3
NetR4_1: R4.1 ; port LED2
NetR5_1: R5.1 ; port LED1
NetR64_1: R64.1 ; port uSD_Detect

Not connected (* = marked no-connect by the designer): CN10 2* 6* 8*

### Notes on the sheet
- Reset Button
- LEDs
- Right side
- (near R5) PE0
- PE1
- PE2
- PE3
- Left side
- The 4 LEDs are top side
- MICRO SD
- (TF) Card
- I2C Extension Connector
- PB9
- (near R119) PC8
- (near R119) PC9
- PC11
- PB10
- PF11
- PC10
- PC12
- PD2
- (near CN10) SSM-104-L-DH (Samtec)
- JOYSTICK
- (near CN13) SMS064FF or SMS128FF
- (near R30) PA0 - WKUP1
- PG1
- PD3
- PF14
- PF15
- PG0
- Title:
- Project:
- Size:
- Date:
- A4
- Reference:
- Sheet:
- Revision:
- of

### Library data of the parts
B1 = SW PUSHBUTTON: SE PUSHBUTTON; Ordered by: Subcon; Assembly: with Back cap; Silkscreen: RESET; ECCN_US/EU: NA
B2 = MT-008A: Joystick; Ordered by: Subcon; Assembly: with button; ECCN_US/EU: NA; Silkscreen: Joystick
C1 = CAP: Capacitor; Value: 100pF; Ordered by: Subcon; ECCN_US/EU: NA; Published: 8-Jun-2000; Revision: July-2002: Re-released for DXP Platform.; Publisher: Altium Limited
CN10 = SSM-104-L-DH: Header, 5-Pin, Dual row; Manuf_1: SAMTEC; Ordered by: Subcon; Silkscreen: RFEEPROM; ECCN_US/EU: NA; Revision: 17-Jul-2002: Re-released for DXP Platform.; Publisher: Altium Limited; Manuf_Part_1: SSM-104-L-DH
CN13 = SMS016AFA5E: Manuf_1: Yamaichi; Ordered by: Subcon; Silkscreen: uSD; ECCN_US/EU: NA; Manuf_Part_1: PJS008-2000
LD1-LD4 = LED2: Typical RED, GREEN, YELLOW, AMBER GaAs LED; Ordered by: Subcon; ECCN_US/EU: EAR99/NEC; Published: 8-Jun-2000; Revision: July-2002: Re-released for DXP Platform.; Publisher: Altium Limited
R2-R5 R23 R64 = Res1: Resistor; Value: 1K; Ordered by: Subcon; ECCN_US/EU: NA; Published: 8-Jun-2000; Revision: July-2002: Re-released for DXP Platform.; Publisher: Altium Limited
R8 R113 R115 R117-R119 = res1: Resistor; Value: 1K; Ordered by: Subcon; ECCN_US/EU: NA; Published: 8-Jun-2000; Revision: July-2002: Re-released for DXP Platform.; Publisher: Altium Limited
R22 R24 R26 R28 R30 = Res1: Resistor; Value: 1K; Ordered by: Subcon; ECCN_US/EU: NA; Fitted: NO; Published: 8-Jun-2000; Revision: July-2002: Re-released for DXP Platform.; Publisher: Altium Limited
SB1 = Circuit Breaker: Ordered by: Subcon; Comments: Solder bridge; ECCN_US/EU: NA; Published: 24-Mar-1999; Revision: July-2002: Re-released for DXP Platform.; Publisher: Altium Limited

## Sheet QSPI.SchDoc: QSPI
size A4; Date: 9/24/2014; Author: P.A.; CompanyName: STMicroelectronics; Organization: Microcontrollers Division; Address1: 12, Rue Jules HOROWITZ; Address2: 38019 Grenoble; Address3: FRANCE; DocumentNumber: MB1209; Revision: D-02; SheetNumber: 5; SheetTotal: 11; Project: STM32F412G-DISCO; ModifiedDate: 6/2/2016
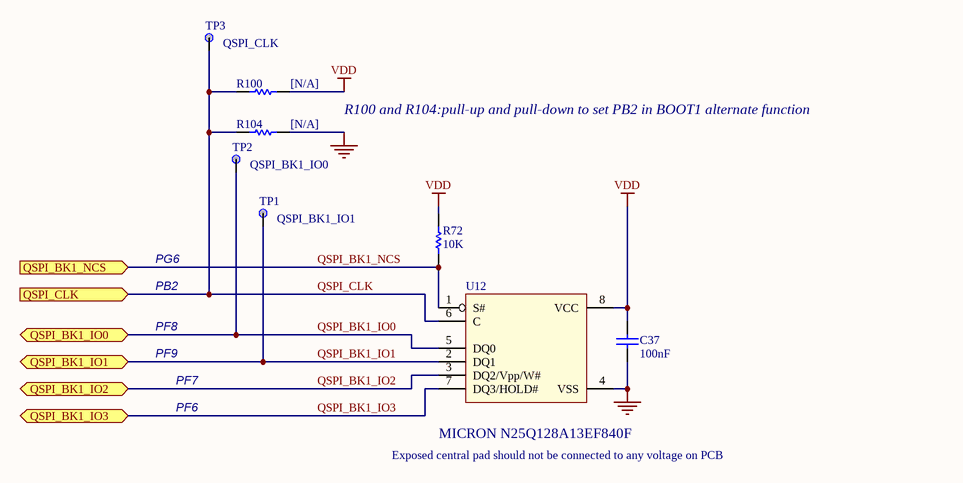
[diagram p3: QSPI.SchDoc]

### Parts
C37  100nF  [0402C]
R72  10K  [0402R]
R100  [N/A]  [0603R]
R104  [N/A]  [0603R]
TP1  TP Name: QSPI_BK1_IO1  [TP_C40]  (hidden comment: TP)
TP2  TP Name: QSPI_BK1_IO0  [TP_C40]  (hidden comment: TP)
TP3  TP Name: QSPI_CLK  [TP_C40]  (hidden comment: TP)
U12  MICRON N25Q128A13EF840F  [DFN8_1R27_6X8_TP4R8X5R8]

### Ports
QSPI_BK1_IO0 (bidir), QSPI_BK1_IO1 (bidir), QSPI_BK1_IO2 (bidir), QSPI_BK1_IO3 (bidir), QSPI_BK1_NCS (in), QSPI_CLK (in)

### Nets
GND: C37.2 R104.1 U12.4(VSS)
VDD: C37.1 R72.2 R100.1 U12.8(VCC)
QSPI_BK1_IO0: TP2.1 U12.5(DQ0) ; port QSPI_BK1_IO0
QSPI_BK1_IO1: TP1.1 U12.2(DQ1) ; port QSPI_BK1_IO1
QSPI_BK1_IO2: U12.3(DQ2/Vpp/W#) ; port QSPI_BK1_IO2
QSPI_BK1_IO3: U12.7(DQ3/HOLD#) ; port QSPI_BK1_IO3
QSPI_BK1_NCS: R72.1 U12.1(S#) ; port QSPI_BK1_NCS
QSPI_CLK: R100.2 R104.2 TP3.1 U12.6(C) ; port QSPI_CLK

### Notes on the sheet
- R100 and R104:pull-up and pull-down to set PB2 in BOOT1 alternate function
- PG6
- PB2
- PF8
- PF9
- PF7
- PF6
- Exposed central pad should not be connected to any voltage on PCB
- Title:
- Project:
- Size:
- Date:
- A4
- Reference:
- Sheet:
- Revision:
- of

### Library data of the parts
C37 = Cap: Capacitor; Value: 10nF; Ordered by: Subcon; ECCN_US/EU: NA; Published: 8-Jun-2000; Revision: July-2002: Re-released for DXP Platform.; Publisher: Altium Limited
R72 = Res_10K_1%_0402: Resistor; Manuf_Part_1: RC0402FR-0710KL; Manuf_1: YAGEO; ECCN_US/EU: NA; Ordered by: Subcon; Value: 10K; Order: RC0402FR-0710KL
R100 R104 = Res1: Resistor; Value: 1K; Ordered by: Subcon; Fitted: NO; ECCN_US/EU: NA; Published: 8-Jun-2000; Revision: July-2002: Re-released for DXP Platform.; Publisher: Altium Limited
TP1-TP3 = TP: Ordered by: Subcon; ECCN_US/EU: NA
U12 = N25Q128A13EF840E: 128Mb, 3V, Multiple I/O Serial Flash Memory, Quad/Dual; Manuf_Part_2: N25Q256A13EF840E; Manuf_Part_3: N25Q512A13EF840E; ECCN_US/EU: 3A991/NEC; Order: N25Q128A13EF840F-ND; Ordered by: ST; Ref St: 9171973; Manuf_Part_1: N25Q128A13EF840E; Manuf_1: MICRON; Distrib: DIGIKEY

## Sheet Power.SchDoc: Power
size A4; Date: 9/24/2014; Author: P.A.; CompanyName: STMicroelectronics; Organization: Microcontrollers Division; Address1: 12, Rue Jules HOROWITZ; Address2: 38019 Grenoble; Address3: FRANCE; DocumentNumber: MB1209; Revision: D-02; SheetNumber: 3; SheetTotal: 11; Project: STM32F412G-DISCO; ModifiedDate: 6/2/2016
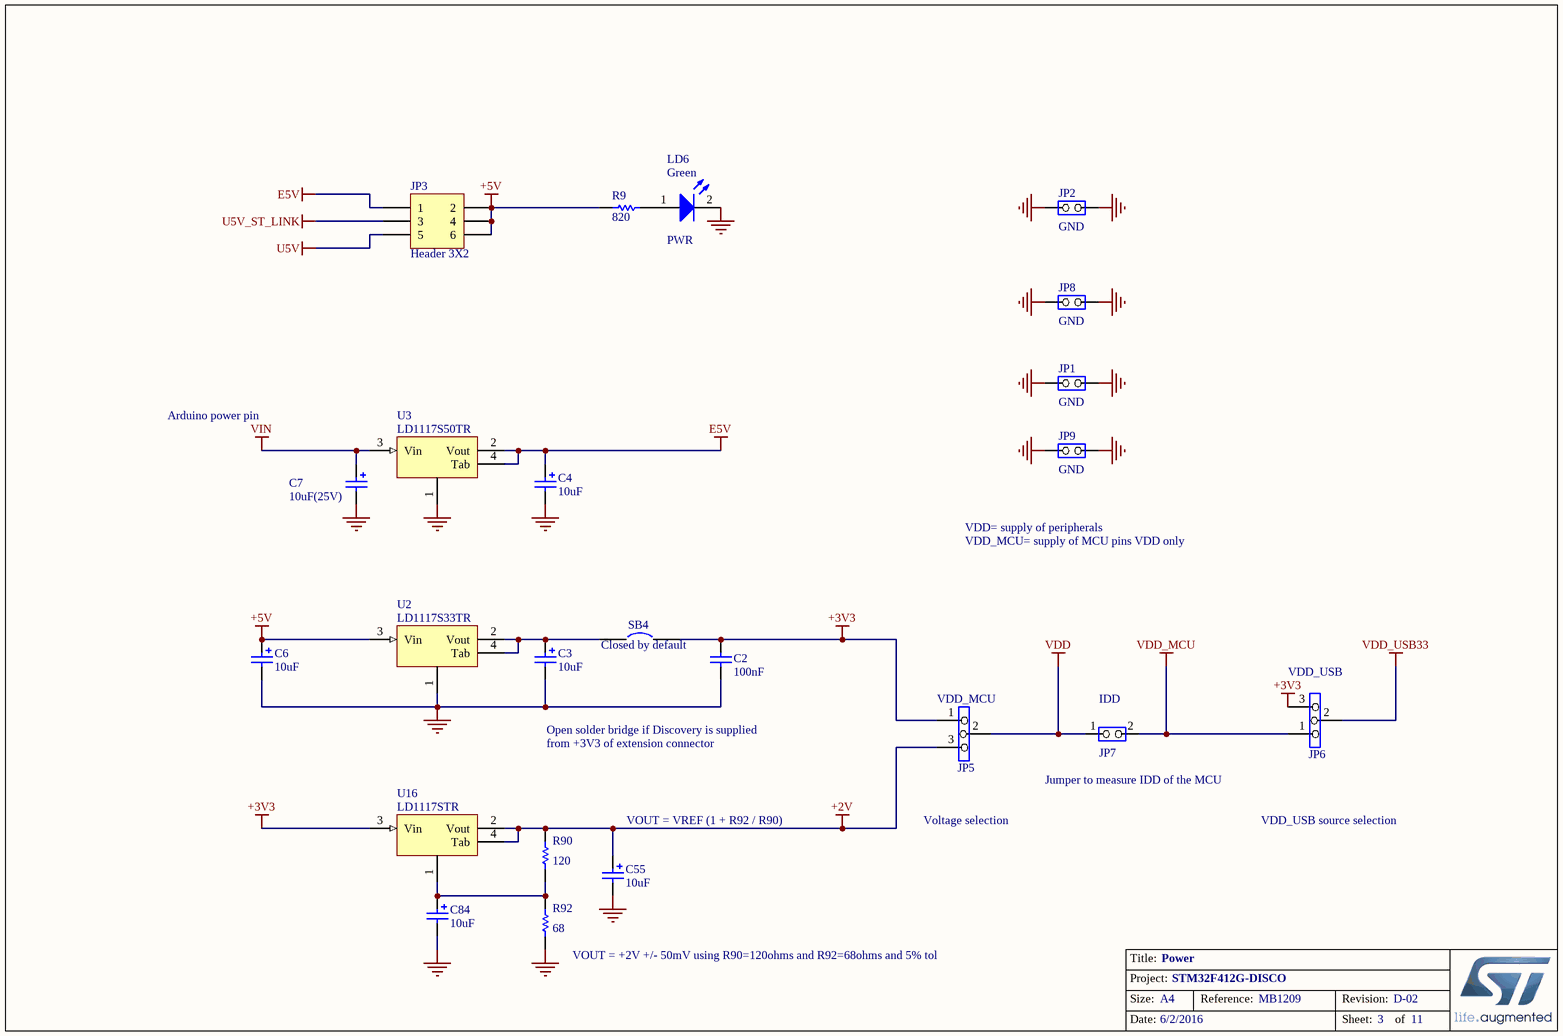
[diagram p4: Power.SchDoc]

### Parts
C2  100nF  [0402C]
C3  10uF  [TAN-A]
C4  10uF  [TAN-A]
C6  10uF  [TAN-A]
C7  10uF(25V)  [TAN-B]
C55  10uF  [TAN-A]
C84  10uF  [TAN-A]
JP1  Silkscreen: GND  [SIP2]  (hidden comment: Jumper2)
JP2  Silkscreen: GND  [SIP2]  (hidden comment: Jumper2)
JP3  Header 3X2  [HDR_2X3_2R54]
JP5  Jumper3  [SIP3]  (value not drawn)
JP6  Jumper3  [SIP3]  (value not drawn)
JP7  Jumper2  [SIP2]  (value not drawn)
JP8  Silkscreen: GND  [SIP2]  (hidden comment: Jumper2)
JP9  Silkscreen: GND  [SIP2]  (hidden comment: Jumper2)
LD6  Green  Silkscreen: PWR  [0603D]
R9  820  [0402R]
R90  120  [0603R]
R92  68  [0603R]
SB4  Closed by default  [SB_0603]
U2  LD1117S33TR  [SOT-223]
U3  LD1117S50TR  [SOT-223]
U16  LD1117STR  [SOT-223]

### Nets
+2V: C55.1 JP5.3 R90.1 U16.2(Vout) U16.4(Tab)
+3V3: C2.1 JP5.1 JP6.3 SB4.2 U16.3(Vin)
+5V: C6.1 JP3.2 JP3.4 JP3.6 R9.2 U2.3(Vin)
E5V: C4.1 JP3.1 U3.2(Vout) U3.4(Tab)
GND: C2.2 C3.2 C4.2 C6.2 C7.2 C55.2 C84.2 JP1.1(COMMON) JP1.2(NO) JP2.1(COMMON) JP2.2(NO) JP8.1(COMMON) JP8.2(NO) JP9.1(COMMON) JP9.2(NO) LD6.2(K) R92.2 U2.1 U3.1
U5V: JP3.5
U5V_ST_LINK: JP3.3
VDD: JP5.2 JP7.1(COMMON)
VDD_MCU: JP6.1 JP7.2(NO)
VDD_USB33: JP6.2
VIN: C7.1 U3.3(Vin)
NetC3_1: C3.1 SB4.1 U2.2(Vout) U2.4(Tab)
NetC84_1: C84.1 R90.2 R92.1 U16.1
NetLD6_1: LD6.1(A) R9.1

### Notes on the sheet
- Arduino power pin
- VDD= supply of peripherals
  VDD_MCU= supply of MCU pins VDD only
- (near JP5) VDD_MCU
- (near JP7) IDD
- (near JP6) VDD_USB
- Open solder bridge if Discovery is supplied
  from +3V3 of extension connector
- (near JP7) Jumper to measure IDD of the MCU
- (near C55) VOUT = VREF (1 + R92 / R90)
- Voltage selection
- VDD_USB source selection
- (near R92) VOUT = +2V +/- 50mV using R90=120ohms and R92=68ohms and 5% tol
- Title:
- Project:
- Size:
- Date:
- A4
- Reference:
- Sheet:
- Revision:
- of

### Library data of the parts
C2 = Cap: as C37 on sheet QSPI; Published: 8-Jun-2000; Revision: July-2002: Re-released for DXP Platform.; Publisher: Altium Limited
C3 C4 C6 C7 C55 C84 = Cap Pol1: Polarized Capacitor (Radial); Ordered by: Subcon; ECCN_US/EU: NA; Published: 8-Jun-2000; Revision: July-2002: Re-released for DXP Platform.; Publisher: Altium Limited; Value: 10uF
JP1 JP2 JP8 JP9 = JP2: Ordered by: Subcon; Assembly: with jumper; ECCN_US/EU: NA
JP3 = Header 3X2: Header, 3-Pin, Dual row; Ordered by: Subcon; Silkscreen: E5V:pins1,2 STLK: pins3,4 USB: pins 5,6; Assembly: 3,4 closed by jumper; ECCN_US/EU: NA; LatestRevisionDate: 17-Jul-2002; LatestRevisionNote: Re-released for DXP Platform.; Publisher: Altium Limited
JP5 = Jumper3: Ordered by: Subcon; Silkscreen: +3V3: pins 1&2 +1V8: pins 2&3; ECCN_US/EU: NA
JP6 = Jumper3: Ordered by: Subcon; Silkscreen: VDD: pins 1&2 +3V3 pins 2&3; ECCN_US/EU: NA
JP7 = JP2: Ordered by: Subcon; Assembly: with jumper; Silkscreen: IDD; ECCN_US/EU: NA
LD6 = LED2: as LD1 on sheet Peripherals; Published: 8-Jun-2000; Revision: July-2002: Re-released for DXP Platform.; Publisher: Altium Limited
R9 R90 R92 = res1: as R8 on sheet Peripherals; Published: 8-Jun-2000; Revision: July-2002: Re-released for DXP Platform.; Publisher: Altium Limited
SB4 = Circuit Breaker: as SB1 on sheet Peripherals; Published: 24-Mar-1999; Revision: July-2002: Re-released for DXP Platform.; Publisher: Altium Limited
U2 = LD1117: Ordered by: ST; ECCN_US/EU: EAR99/NEC; Ref St: 9176186; Manuf_1: ST; Manuf_Part_1: LD1117S33TR
U3 = LD1117: Ordered by: ST; ECCN_US/EU: EAR99/NEC; Ref St: 9176133; Manuf_1: ST; Manuf_Part_1: LD1117S50TR
U16 = LD1117: Ordered by: ST; ECCN_US/EU: EAR99/NEC; Ref St: 9176138; Manuf_1: ST; Manuf_Part_1: LD1117STR

## Sheet ST_LINK_V2-1_2.SCHDOC: ST-LINK/V2-1
size A4; Date: 04/02/2015; Author: P.A.; CompanyName: STMicroelectronics; Organization: Microcontrollers Division; Address1: 12, Rue Jules HOROWITZ; Address2: 38019 Grenoble; Address3: FRANCE; DocumentNumber: MB1209; Revision: D-02; SheetNumber: 11; SheetTotal: 11; Project: STM32F412G-DISCO; ModifiedDate: 6/2/2016
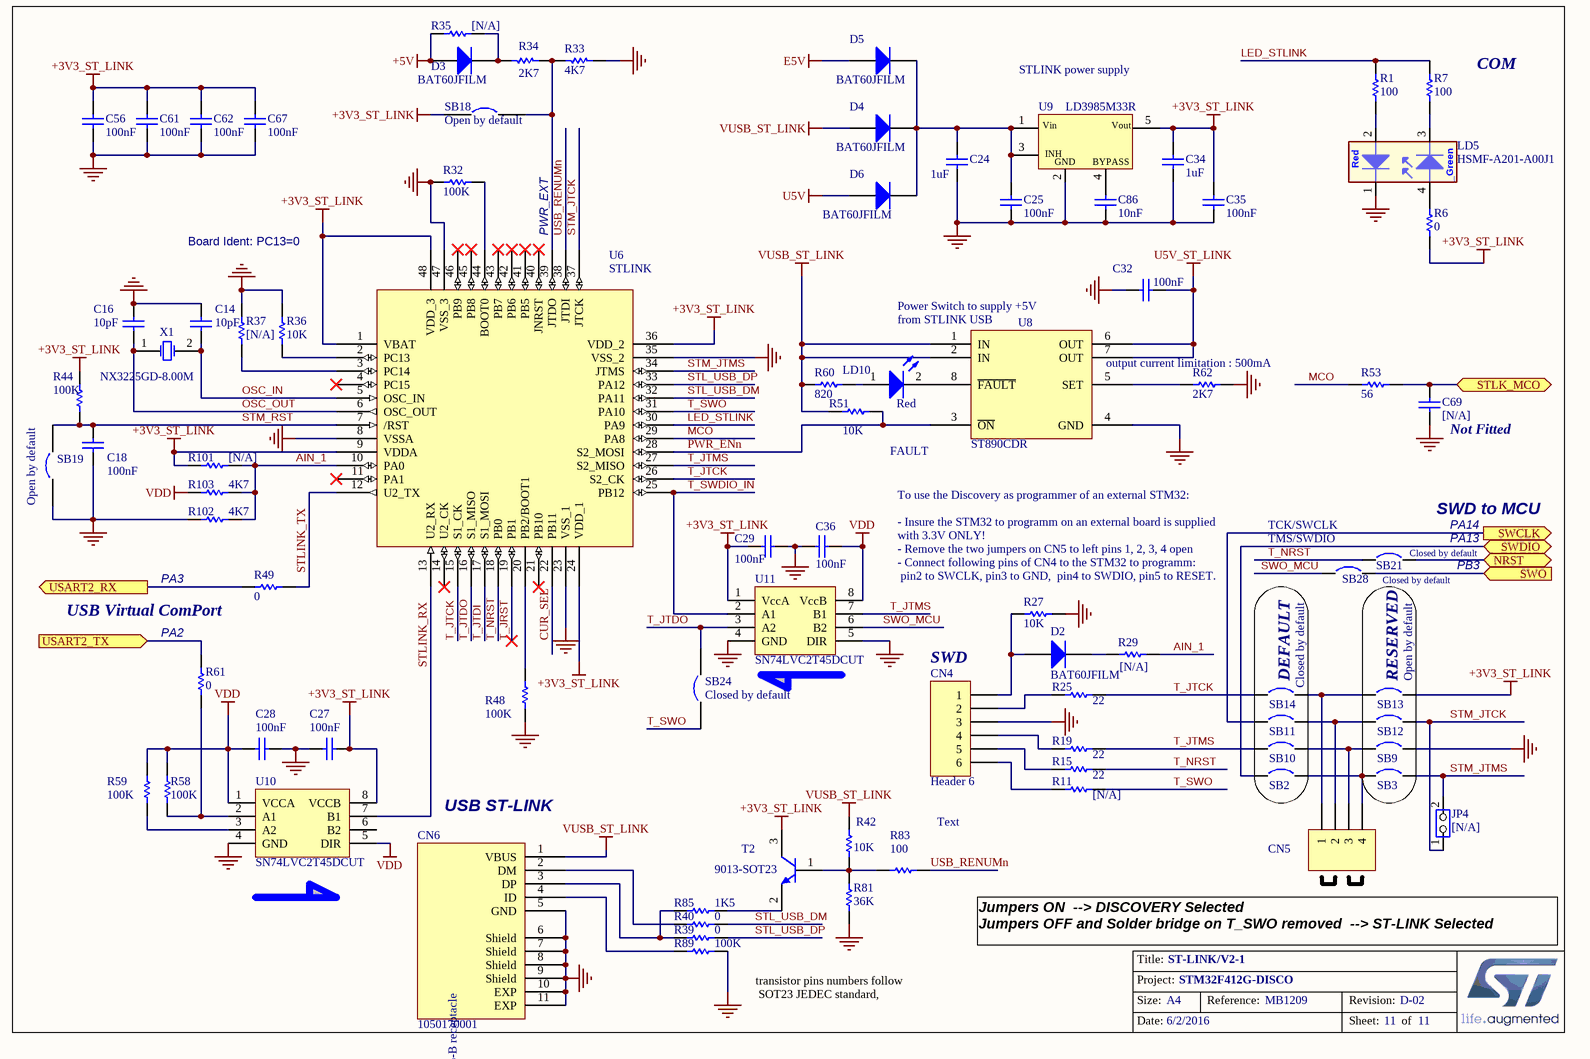
[diagram p5: ST_LINK_V2-1_2.SCHDOC]

### Parts
C14  10pF  [0603C]
C16  10pF  [0603C]
C18  100nF  [0402C]
C24  1uF  [0603C]
C25  100nF  [0402C]
C27  100nF  [0402C]
C28  100nF  [0402C]
C29  100nF  [0402C]
C32  100nF  [0402C]
C34  1uF  [0603C]
C35  100nF  [0402C]
C36  100nF  [0402C]
C56  100nF  [0402C]
C61  100nF  [0402C]
C62  100nF  [0402C]
C67  100nF  [0402C]
C69  [N/A]  [0603C]
C86  10nF  [0603C]
CN4  Header 6  [HDR_1X6_2R54_W]
CN5  Header 4  [HDR_1X4_2R54_W]  (value not drawn)
CN6  1050170001  [Molex_1050170001]
D2  BAT60JFILM  [SOD-323]
D3  BAT60JFILM  [SOD-323]
D4  BAT60JFILM  [SOD-323]
D5  BAT60JFILM  [SOD-323]
D6  BAT60JFILM  [SOD-323]
JP4  [N/A]  [SIP2]
LD5  HSMF-A201-A00J1  [LED2_3528]
LD10  Red  Silkscreen: FAULT  [0603D]
R1  100  [0402R]
R6  0  [SB_0603]
R7  100  [0402R]
R11  [N/A]  [0402R]
R15  22  [0402R]
R19  22  [0402R]
R25  22  [0402R]
R27  10K  [0402R]
R29  [N/A]  [0402R]
R32  100K  [0402R]
R33  4K7  [0603R]
R34  2K7  [0603R]
R35  [N/A]  [0402R]
R36  10K  [0402R]
R37  [N/A]  [0603R]
R39  0  [SB_0603]
R40  0  [SB_0603]
R42  10K  [0402R]
R44  100K  [0402R]
R48  100K  [0402R]
R49  0  [SB_0603]
R51  10K  [0402R]
R53  56  [0603R]
R58  100K  [0402R]
R59  100K  [0402R]
R60  820  [0402R]
R61  0  [SB_0603]
R62  2K7  [0603R]
R81  36K  [0603R]
R83  100  [0402R]
R85  1K5  [0603R]
R89  100K  [0402R]
R101  [N/A]  [0603R]
R102  4K7  [0603R]
R103  4K7  [0603R]
SB2  Closed by default  [SB_0603]
SB3  Open by default  [SB_0603]
SB9  Open by default  [SB_0603]  (value not drawn)
SB10  Closed by default  [SB_0603]  (value not drawn)
SB11  Closed by default  [SB_0603]  (value not drawn)
SB12  Open by default  [SB_0603]  (value not drawn)
SB13  Open by default  [SB_0603]  (value not drawn)
SB14  Closed by default  [SB_0603]  (value not drawn)
SB18  Open by default  [SB_0603]
SB19  Open by default  [SB_0603]
SB21  Closed by default  [SB_0603]
SB24  Closed by default  [SB_0603]
SB28  Closed by default  [SB_0603]
T2  9013-SOT23  [SOT-23]
U6  STLINK  [LQFP48_0R5_9X9]
U8  ST890CDR  [SOIC8_1R27_4R9X6]
U9  LD3985M33R  [SOT23-5]
U10  SN74LVC2T45DCUT  [USOP8_0R5_2X3R1]
U11  SN74LVC2T45DCUT  [USOP8_0R5_2X3R1]
X1  NX3225GD-8.00M  [XTAL_2SM_3R2X2R5]

### Blocks framed on the sheet
DEFAULT: SB2 SB10 SB11 SB14
RESERVED: SB3 SB9 SB12 SB13

### Ports
NRST, STLK_MCO, SWCLK (out), SWDIO (bidir), SWO (in), USART2_RX (out), USART2_TX (in)

### Nets
+3V3_ST_LINK: C27.1 C29.1 C34.1 C35.2 C56.2 C61.2 C62.2 C67.2 R6.2 R44.2 R101.1 SB13.2 SB18.1 T2.3(C) U6.1(VBAT) U6.9(VDDA) U6.24(VDD_1) U6.36(VDD_2) U6.48(VDD_3) U9.5(Vout) U10.8(VCCB) U11.1(VccA)
+5V: D3.1(A) R35.1
E5V: D5.1(A)
GND: C14.2 C16.2 C18.1 C24.1 C25.1 C27.2 C28.2 C29.2 C32.1 C34.2 C35.1 C36.1 C56.1 C61.1 C62.1 C67.1 C69.2 C86.1 CN4.3 CN6.5(GND) CN6.6(Shield) CN6.7(Shield) CN6.8(Shield) CN6.9(Shield) CN6.10(EXP) CN6.11(EXP) LD5.1 R27.1 R32.1 R33.2 R36.1 R37.1 R48.1 R62.2 R81.1 R89.2 R102.1 SB9.2 SB19.1 U6.8(VSSA) U6.23(VSS_1) U6.35(VSS_2) U6.47(VSS_3) U8.4(GND) U9.2(GND) U10.4(GND) U11.4(GND) U11.5(DIR)
U5V: D6.1(A)
U5V_ST_LINK: C32.2 U8.6(OUT) U8.7(OUT)
VDD: C28.1 C36.2 R58.1 R59.1 R103.1 U10.1(VCCA) U10.5(DIR) U11.8(VccB)
VUSB_ST_LINK: CN6.1(VBUS) D4.1(A) R42.2 R51.1 R60.2 U8.1(IN) U8.2(IN)
AIN_1: R29.2 R101.2 R102.2 R103.2 U6.10(PA0)
CUR_SEL: U6.22(PB11)
LED_STLINK: R1.1 R7.1 U6.30(PA9)
MCO: R53.2 U6.29(PA8)
NRST: SB21.2 ; port NRST
OSC_IN: C14.1 U6.5(OSC_IN) X1.2(OSC2)
OSC_OUT: C16.1 U6.6(OSC_OUT) X1.1(OSC1)
PWR_ENn: R51.2 U6.28(S2_MOSI) U8.3(~{ON})
STL_USB_DM: R40.2 U6.32(PA11)
STL_USB_DP: R39.2 U6.33(PA12)
STLINK_RX: U6.13(U2_RX) U10.7(B1)
STLINK_TX: R49.2 U6.12(U2_TX)
STM_JTCK: JP4.1(COMMON) SB12.2 U6.37(JTCK)
STM_JTMS: JP4.2(NO) SB3.2 U6.34(JTMS)
STM_RST: C18.2 R44.1 SB19.2 U6.7(/RST)
SWO_MCU: SB28.1 U11.6(B2)
T_JRST: U6.19(PB1)
T_JTCK: R25.2 SB14.1 U6.15(S1_CK) U6.26(S2_CK)
T_JTDI: U6.17(S1_MOSI)
T_JTDO: SB24.2 U6.16(S1_MISO) U11.3(A2)
T_JTMS: R19.2 SB10.1 U6.27(S2_MISO) U11.7(B1)
T_NRST: R15.2 SB21.1 U6.18(PB0)
T_SWDIO_IN: U6.25(PB12) U11.2(A1)
T_SWO: R11.2 SB24.1 U6.31(PA10)
USB_RENUMn: R83.2 U6.38(JTDI)
NetC24_2: C24.2 C25.2 D4.2(K) D5.2(K) D6.2(K) U9.1(Vin) U9.3(CE)
NetC69_1: C69.1 R53.1 ; port STLK_MCO
NetC86_2: C86.2 U9.4(BYPASS)
NetCN4_1: CN4.1 D2.1(A) R27.2
NetCN4_2: CN4.2 R25.1
NetCN4_4: CN4.4 R19.1
NetCN4_5: CN4.5 R15.1
NetCN4_6: CN4.6 R11.1
NetCN5_1: CN5.1 SB13.1 SB14.2
NetCN5_2: CN5.2 SB11.2 SB12.1
NetCN5_3: CN5.3 SB9.1 SB10.2
NetCN5_4: CN5.4 SB2.2 SB3.1
NetCN6_2: CN6.2(DM) R40.1
NetCN6_3: CN6.3(DP) R39.1 R85.1
NetCN6_4: CN6.4(ID) R89.1
NetD2_2: D2.2(K) R29.1
NetD3_2: D3.2(K) R34.1 R35.2
NetLD5_2: LD5.2 R1.2
NetLD5_3: LD5.3 R7.2
NetLD5_4: LD5.4 R6.1
NetLD10_1: LD10.1(A) R60.1
NetLD10_2: LD10.2(K) U8.8(~{FAULT})
NetR32_2: R32.2 U6.44(BOOT0)
NetR33_1: R33.1 R34.2 SB18.2 U6.39(JTDO)
NetR36_2: R36.2 U6.2(PC13)
NetR37_2: R37.2 U6.3(PC14)
NetR42_1: R42.1 R81.2 R83.1 T2.1(B)
NetR48_2: R48.2 U6.20(PB2/BOOT1)
NetR49_1: R49.1 ; port USART2_RX
NetR58_2: R58.2 R61.2 U10.2(A1)
NetR59_2: R59.2 U10.3(A2)
NetR61_1: R61.1 ; port USART2_TX
NetR62_1: R62.1 U8.5(SET)
NetR85_2: R85.2 T2.2(E)
NetSB2_1: SB2.1 ; port SWDIO
NetSB11_1: SB11.1 ; port SWCLK
NetSB28_2: SB28.2 ; port SWO

Not connected (* = marked no-connect by the designer): U6 4(PC15)* 11(PA1)* 14(U2_CK)* 21(PB10)* 40(JNRST)* 41(PB5)* 42(PB6)* 43(PB7)* 45(PB8)* 46(PB9)*; U10 6(B2)

### Notes on the sheet
- (near U9) STLINK power supply
- (near R7) COM
- Board Ident: PC13=0
- PWR_EXT
- (near U8) Power Switch to supply +5V from STLINK USB
- output current limitation : 500mA
- (near C69) Not Fitted
- (near SB21) SWD to MCU
- PA3
- (near R27) To use the Discovery as programmer of an external STM32:
  - Insure the STM32 to programm on an external board is supplied with 3.3V ONLY!
  - Remove the two jumpers on CN5 to left pins 1, 2, 3, 4 open
  - Connect following pins of CN4 to the STM32 to programm:
  pin2 to SWCLK, pin3 to GND,  pin4 to SWDIO, pin5 to RESET.
- TCK/SWCLK
- (near SB28) TMS/SWDIO
- PA14
- (near SB21) PA13
- PB3
- USB Virtual ComPort
- (near R61) PA2
- (near CN4) SWD
- (near CN6) USB ST-LINK
- Text
- Jumpers ON  --> DISCOVERY Selected
  Jumpers OFF and Solder bridge on T_SWO removed  --> ST-LINK Selected
- transistor pins numbers follow
  SOT23 JEDEC standard,
- Title:
- Project:
- Size:
- Date:
- A4
- Reference:
- Sheet:
- Revision:
- of
- (in symbol 1050170001) USB_Micro-B receptacle
- (in symbol LD3985M33R) INH
- (in symbol LD_BICOLOR_CMS) Red; _Green

### Library data of the parts
C14 C16 = Capacitor_ST: Capacitor 0402 / 0603 / 0805; Value: 100nF; Ordered by: Subcon; ECCN_US/EU: NA; Revision: July-2002: Re-released for DXP Platform.
C18 C25 C32 C35 C56 C61 C62 C67 = Capacitor_ST: Capacitor 0402 / 0603 / 0805; Ordered by: Subcon; ECCN_US/EU: NA; Revision: July-2002: Re-released for DXP Platform.; Value: 100nF
C24 C34 = CAP SMD 0603  X5R 1µF 25V 10%: Capacitor; Value: 1µF; Rated voltage: 25V; Tolerance: 10%; Ordered by: Subcon; ECCN_US/EU: NA; Manufacturer: *; Manufacturer P/N: *; Order code Farnell: 1288202RL; Power: *; Technology: X5R; Temperature  Factor: *; Temperature Max: +125°C; Temperature Min: -55°C; STS Code: *
C27-C29 C36 = CAP: as C1 on sheet Peripherals; Published: 8-Jun-2000; Revision: July-2002: Re-released for DXP Platform.; Publisher: Altium Limited
C69 = Cap_20pF_NPO_5%_0402: Capacitor,20pF,50V,NPO,5%,0402,YAGEO; Order: CC0402JRNPO9BN200; Fitted: NO; Ordered by: Subcon; ECCN_US/EU: NA; Revision: July-2002: Re-released for DXP Platform.; Value: 20pF; Manuf_1: YAGEO; Manuf_Part_1: CC0402JRNPO9BN200
C86 = CAP SMD 0603  X7R 10000PF 50V 10%: 0603  X7R 10NF; Order code RS: 2040779; Rated voltage: 50V; Tolerance: 10%; Ordered by: Subcon; ECCN_US/EU: NA; Order code Farnell: 7569548RL; Value: 10NF; Power: *; Technology: X7R; Temperature Factor: *; Temperature Min: -55°C; Temperature Max: +125°C; STS Code: *
CN4 = Header 6: Header, 6-Pin; Ordered by: Subcon; Silkscreen: SWD; ECCN_US/EU: NA; LatestRevisionDate: 17-Jul-2002; LatestRevisionNote: Re-released for DXP Platform.; Publisher: Altium Limited
CN5 = Header 4: Header, 4-Pin; Assembly: with 2 jumpers; Ordered by: Subcon; Silkscreen: ST-LINK/DISCOVERY; ECCN_US/EU: NA; Revision: 17-Jul-2002: Re-released for DXP Platform.; Publisher: Altium Limited
CN6 = 1050170001: Silkscreen: USB; Ordered by: Subcon; ECCN_US/EU: NA
D2-D6 = BAT60JFILM: Provided: ST; ECCN_US/EU: EAR99/NEC; Ref St: 9151097; Revision: July-2002: Re-released for DXP Platform.; Order: BAT60JFILM; Manuf_Part_1: BAT60JFILM; Manuf_1: ST; Distrib: ST; Ordered by: ST
JP4 = JP2: Ordered by: Subcon; Fitted: NO; ECCN_US/EU: NA
LD5 = LD_BICOLOR_CMS: Bicolor Led; Manuf_1: Avago Technologies; Manuf_2: everluck; Manuf_Part_2: LE-RGW35280; ECCN_US/EU: EAR99/NEC; Silkscreen: COM; Ordered by: Subcon; Distrib: RADIOSPARES; Manuf_Part_1: HSMF-A201-A00J1; Footprint: HSMF-A201
LD10 = LED2: as LD1 on sheet Peripherals; Published: 8-Jun-2000; Revision: July-2002: Re-released for DXP Platform.; Publisher: Altium Limited
R1 R6 R7 R33 R34 R42 R49 R53 R58 R59 R61 R81 = Res1: as R2 on sheet Peripherals; Published: 8-Jun-2000; Revision: July-2002: Re-released for DXP Platform.; Publisher: Altium Limited
R11 = res1: Resistor; Value: 22; Ordered by: Subcon; ECCN_US/EU: NA; Fitted: NO; Published: 8-Jun-2000; Revision: July-2002: Re-released for DXP Platform.; Publisher: Altium Limited
R15 R19 R25 R27 = res1: Resistor; Ordered by: Subcon; ECCN_US/EU: NA; Published: 8-Jun-2000; Revision: July-2002: Re-released for DXP Platform.; Publisher: Altium Limited
  R15 R19 R25: Value: 22
  R27: Value: 10K
R29 = Res_NA_0402: Resistor,[NA],0402; Fitted: NO; Ordered by: Subcon; ECCN_US/EU: NA; Value: [NA]
R32 R44 R48 R62 R83 R102 R103 = Resistor_ST: Resistor 0402 / 0603 / 0805; Value: 10K; Ordered by: Subcon; ECCN_US/EU: NA
R35 = Resistor_ST: Resistor; Value: 10K; Ordered by: Subcon; Fitted: NO; ECCN_US/EU: NA
R36 R51 = Resistor_ST: Resistor; Ordered by: Subcon; ECCN_US/EU: NA; Value: 10K
R37 R101 = Resistor_ST: Resistor 0402 / 0603 / 0805; Value: 10K; Fitted: NO; Ordered by: Subcon; ECCN_US/EU: NA
R39 R40 R85 = Resistor_ST: Resistor; Value: 10K; Ordered by: Subcon; ECCN_US/EU: NA
R60 R89 = res1: as R8 on sheet Peripherals; Published: 8-Jun-2000; Revision: July-2002: Re-released for DXP Platform.; Publisher: Altium Limited
SB2 SB10 SB11 SB14 SB21 SB28 = Circuit Breaker: Solder: YES; Ordered by: Subcon; ECCN_US/EU: NA; Revision: July-2002: Re-released for DXP Platform.
SB3 SB9 SB12 SB13 = Circuit Breaker: Solder: NO; Fitted: NO; Ordered by: Subcon; ECCN_US/EU: NA; Revision: July-2002: Re-released for DXP Platform.
SB18 SB19 = Circuit Breaker: Ordered by: Subcon; Comments: Solder bridge; Fitted: NO; ECCN_US/EU: NA; Published: 24-Mar-1999; Revision: July-2002: Re-released for DXP Platform.; Publisher: Altium Limited
SB24 = Circuit Breaker: as SB1 on sheet Peripherals; Published: 24-Mar-1999; Revision: July-2002: Re-released for DXP Platform.; Publisher: Altium Limited
T2 = NPN: NPN Bipolar Transistor; Manuf_Part_1: MMBT9013; Code - JEDEC: TO-226-AA; Ordered by: Subcon; ECCN_US/EU: EAR99/NEC; Published: 8-Jun-2000; Revision: July-2002: Re-released for DXP Platform.; Publisher: Altium Limited
U6 = STM32F10x(48pin): Manuf_Part_1: STM32F103CBT6; Ordered by: ST; ECCN_US/EU: 3A991A2/NEC; Ref St: 9175111; Distrib: ST; Manuf_1: ST
U8 = ST890CDR: Ordered by: ST; Ref St: 9172002; ECCN_US/EU: EAR99/NEC; Manuf_1: ST; Manuf_Part_1: ST890CDR
U9 = LD3985M33R: Ultra low drop-low noise BiCMOS voltage, regulators low ESR capacitors compatible; Manuf_1: ST; Manuf_Part_2: LDK120DM33R; Ref St: 9176161; ECCN_US/EU: EAR99/NEC; Manuf_Part_1: LD3985M33R; Provided: ST; Distrib: ST; Order: LD3985M33R; Ordered by: ST; Manuf_2: ST
U10 U11 = SN74LVC2T45DCUT: Manuf_1: TI; Ordered by: Subcon; ECCN_US/EU: EAR99/NEC; Manuf_Part_1: SN74LVC2T45DCUT
X1 = XTAL_8M_NX3225GD: Crystal 8Mhz, 8pF, -+50PPM, SMD; Manuf_1: NDK; Manuf_Part_1: NX3225GD 8MHz EXS00A-CG04874; Manuf_Part_2: NX3225GD-8.000M-STD-CRA-3; ECCN_US/EU: EAR99/NEC; NDK Ref: X3127326; Ref St: 9157029; Provided: ST; Order: NX3225GD 8MHz EXS00A-CG04874; Ordered by: ST

## Nets that join several sheets
+3V3: Extension_connectors (P2.5 P2.6), Peripherals (LD1.1 LD2.1 LD3.1 LD4.1), Power (5 pins)
+5V: Extension_connectors (P2.3 P2.4), Power (6 pins), ST_LINK_V2-1_2 (D3.1 R35.1)
E5V: Power (C4.1 JP3.1 U3.2 U3.4), ST_LINK_V2-1_2 (D5.1)
GND: Extension_connectors (10 pins), Peripherals (11 pins), QSPI (C37.2 R104.1 U12.4), Power (19 pins), ST_LINK_V2-1_2 (48 pins)
U5V: Power (JP3.5), ST_LINK_V2-1_2 (D6.1)
U5V_ST_LINK: Power (JP3.3), ST_LINK_V2-1_2 (C32.2 U8.6 U8.7)
VDD: Peripherals (9 pins), QSPI (C37.1 R72.2 R100.1 U12.8), Power (JP5.2 JP7.1), ST_LINK_V2-1_2 (8 pins)
VDD_MCU: Extension_connectors (P1.3 P1.4 P2.22), Power (JP6.1 JP7.2)
NRST: Extension_connectors (P1.6), Peripherals (SB1.1), ST_LINK_V2-1_2 (SB21.2)